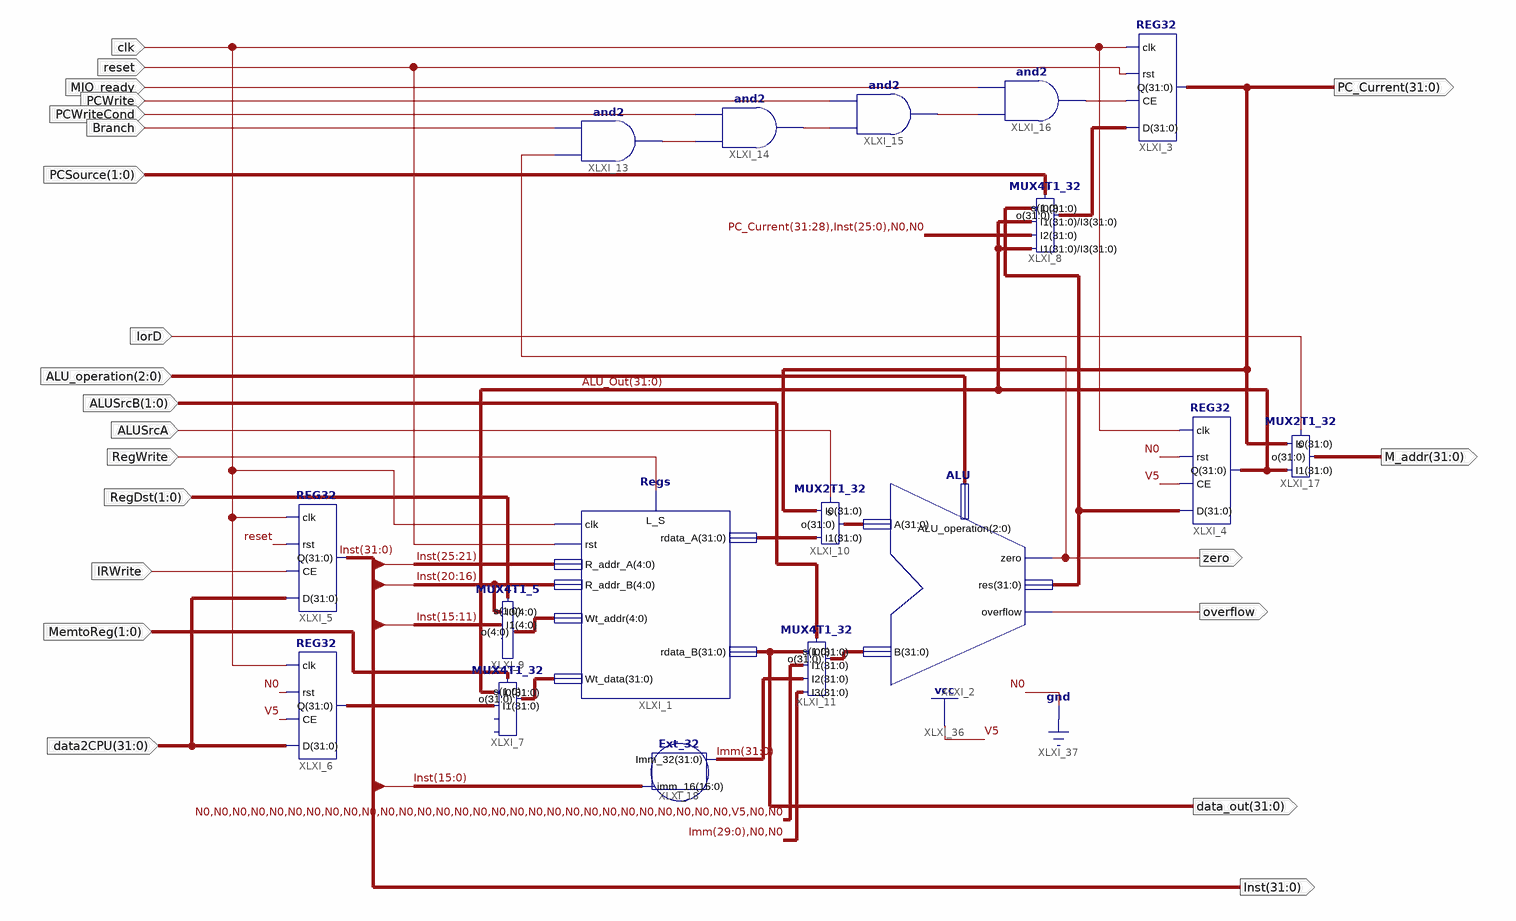
[diagram p0: schematic sheet 1]
// Xilinx ISE schematic MDPath.sch (kintex7) as structural Verilog: 17 symbols, 22 ports
module MDPath (
  input  clk,
  input  reset,
  input  MIO_ready,
  input  PCWrite,
  input  PCWriteCond,
  input  Branch,
  input  [1:0] PCSource,
  input  IorD,
  input  [2:0] ALU_operation,
  input  [1:0] ALUSrcB,
  input  ALUSrcA,
  input  RegWrite,
  input  [1:0] MemtoReg,
  input  [31:0] data2CPU,
  input  IRWrite,
  input  [1:0] RegDst,
  output [31:0] PC_Current,
  output [31:0] M_addr,
  output zero,
  output [31:0] data_out,
  output [31:0] Inst,
  output overflow
);

  wire XLXN_2, XLXN_3, XLXN_4, XLXN_5;
  wire [4:0] XLXN_65;
  wire [31:0] ALU_Out, Imm, XLXN_14, XLXN_15, XLXN_50, XLXN_51, XLXN_53, XLXN_66, XLXN_89;

  Regs XLXI_1 (
    .clk(clk), .L_S(RegWrite), .rdata_A(XLXN_50), .rst(reset), .Wt_data(XLXN_66), .rdata_B(data_out),
    .R_addr_A(Inst[25:21]), .R_addr_B(Inst[20:16]), .Wt_addr(XLXN_65));
  MUX4T1_32 XLXI_7 (.s(MemtoReg), .I0(ALU_Out), .I1(XLXN_89), .o(XLXN_66));  // open: I2, I3
  MUX4T1_5 XLXI_9 (.s(RegDst), .I1(Inst[15:11]), .I0(Inst[20:16]), .o(XLXN_65));  // open: I2, I3
  MUX2T1_32 XLXI_10 (.s(ALUSrcA), .I0(PC_Current), .I1(XLXN_50), .o(XLXN_51));
  MUX4T1_32 XLXI_11 (
    .s(ALUSrcB), .I0(data_out), .I1(32'b00000000000000000000000000000100), .I2(Imm), .I3({Imm[29:0], 2'b00}),
    .o(XLXN_53));
  MUX2T1_32 XLXI_17 (.s(IorD), .I0(PC_Current), .I1(ALU_Out), .o(M_addr));
  Ext_32 XLXI_18 (.imm_16(Inst[15:0]), .Imm_32(Imm));
  and XLXI_13 (XLXN_2, zero, Branch);
  and XLXI_14 (XLXN_3, XLXN_2, PCWriteCond);
  and XLXI_15 (XLXN_4, XLXN_3, PCWrite);
  and XLXI_16 (XLXN_5, XLXN_4, MIO_ready);
  REG32 XLXI_3 (.D(XLXN_14), .CE(XLXN_5), .rst(reset), .clk(clk), .Q(PC_Current));
  MUX4T1_32 XLXI_8 (
    .s(PCSource), .I0(XLXN_15), .I1(ALU_Out), .I2({PC_Current[31:28], Inst[25:0], 2'b00}), .I3(ALU_Out),
    .o(XLXN_14));
  REG32 XLXI_4 (.D(XLXN_15), .CE(1'b1), .rst(1'b0), .clk(clk), .Q(ALU_Out));
  ALU XLXI_2 (.zero(zero), .res(XLXN_15), .overflow(overflow), .A(XLXN_51), .B(XLXN_53), .ALU_operation(ALU_operation));
  REG32 XLXI_5 (.D(data2CPU), .CE(IRWrite), .rst(reset), .clk(clk), .Q(Inst));
  REG32 XLXI_6 (.D(data2CPU), .CE(1'b1), .rst(1'b0), .clk(clk), .Q(XLXN_89));
endmodule
